# EAGLE schematic main (EAGLE 9.4.2)
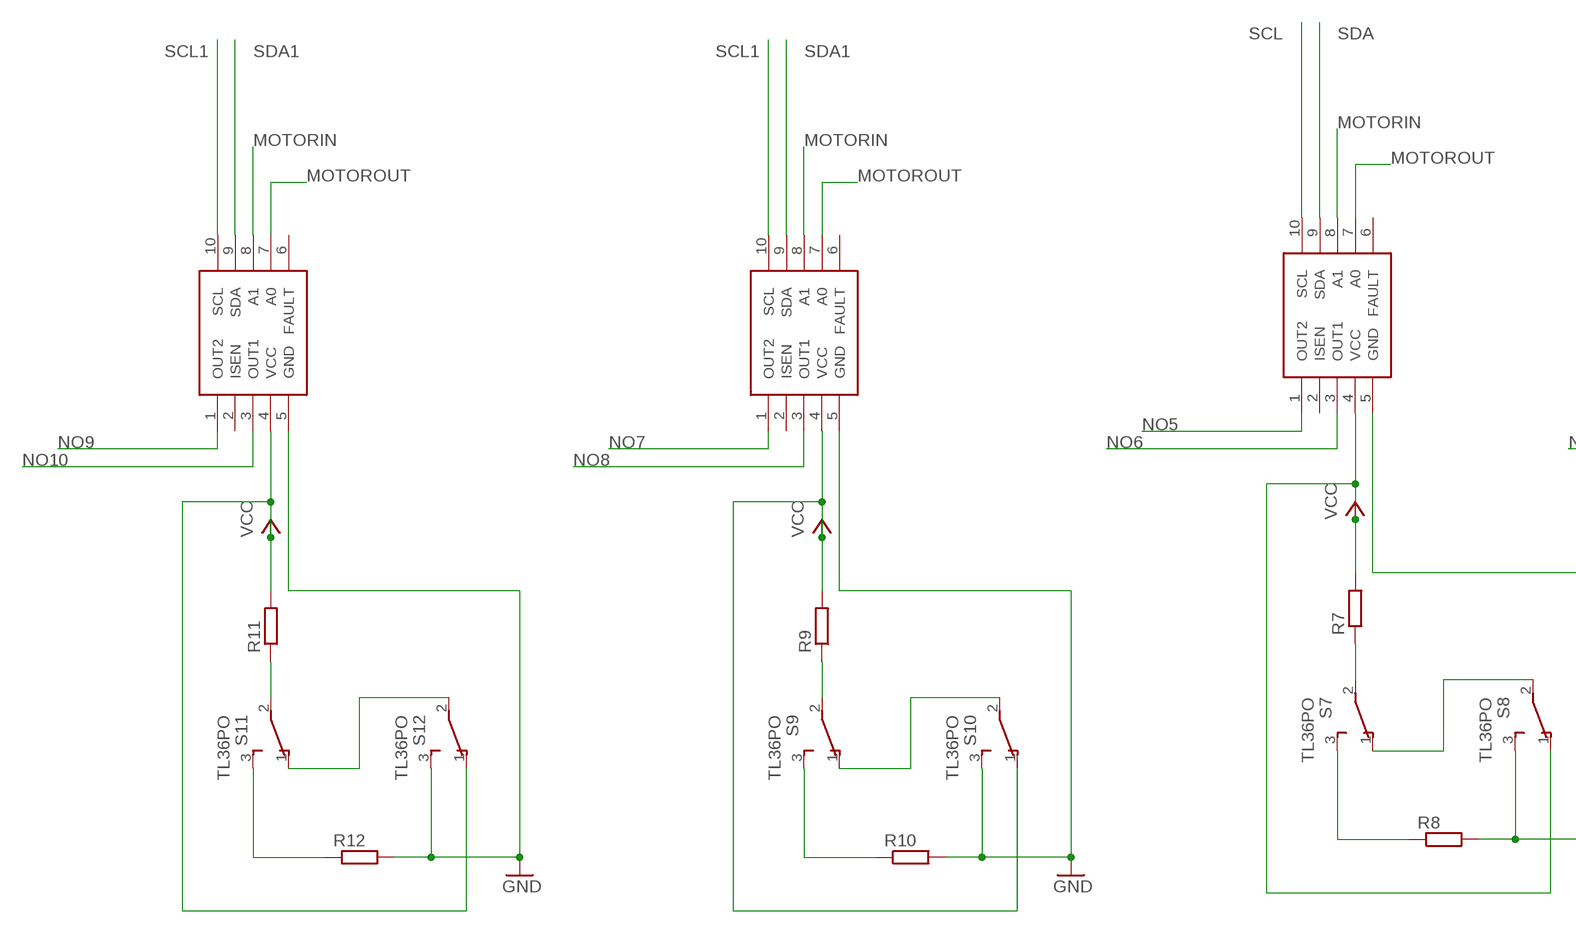
[diagram p0: schematic, sheet 1, part 1 of 2]
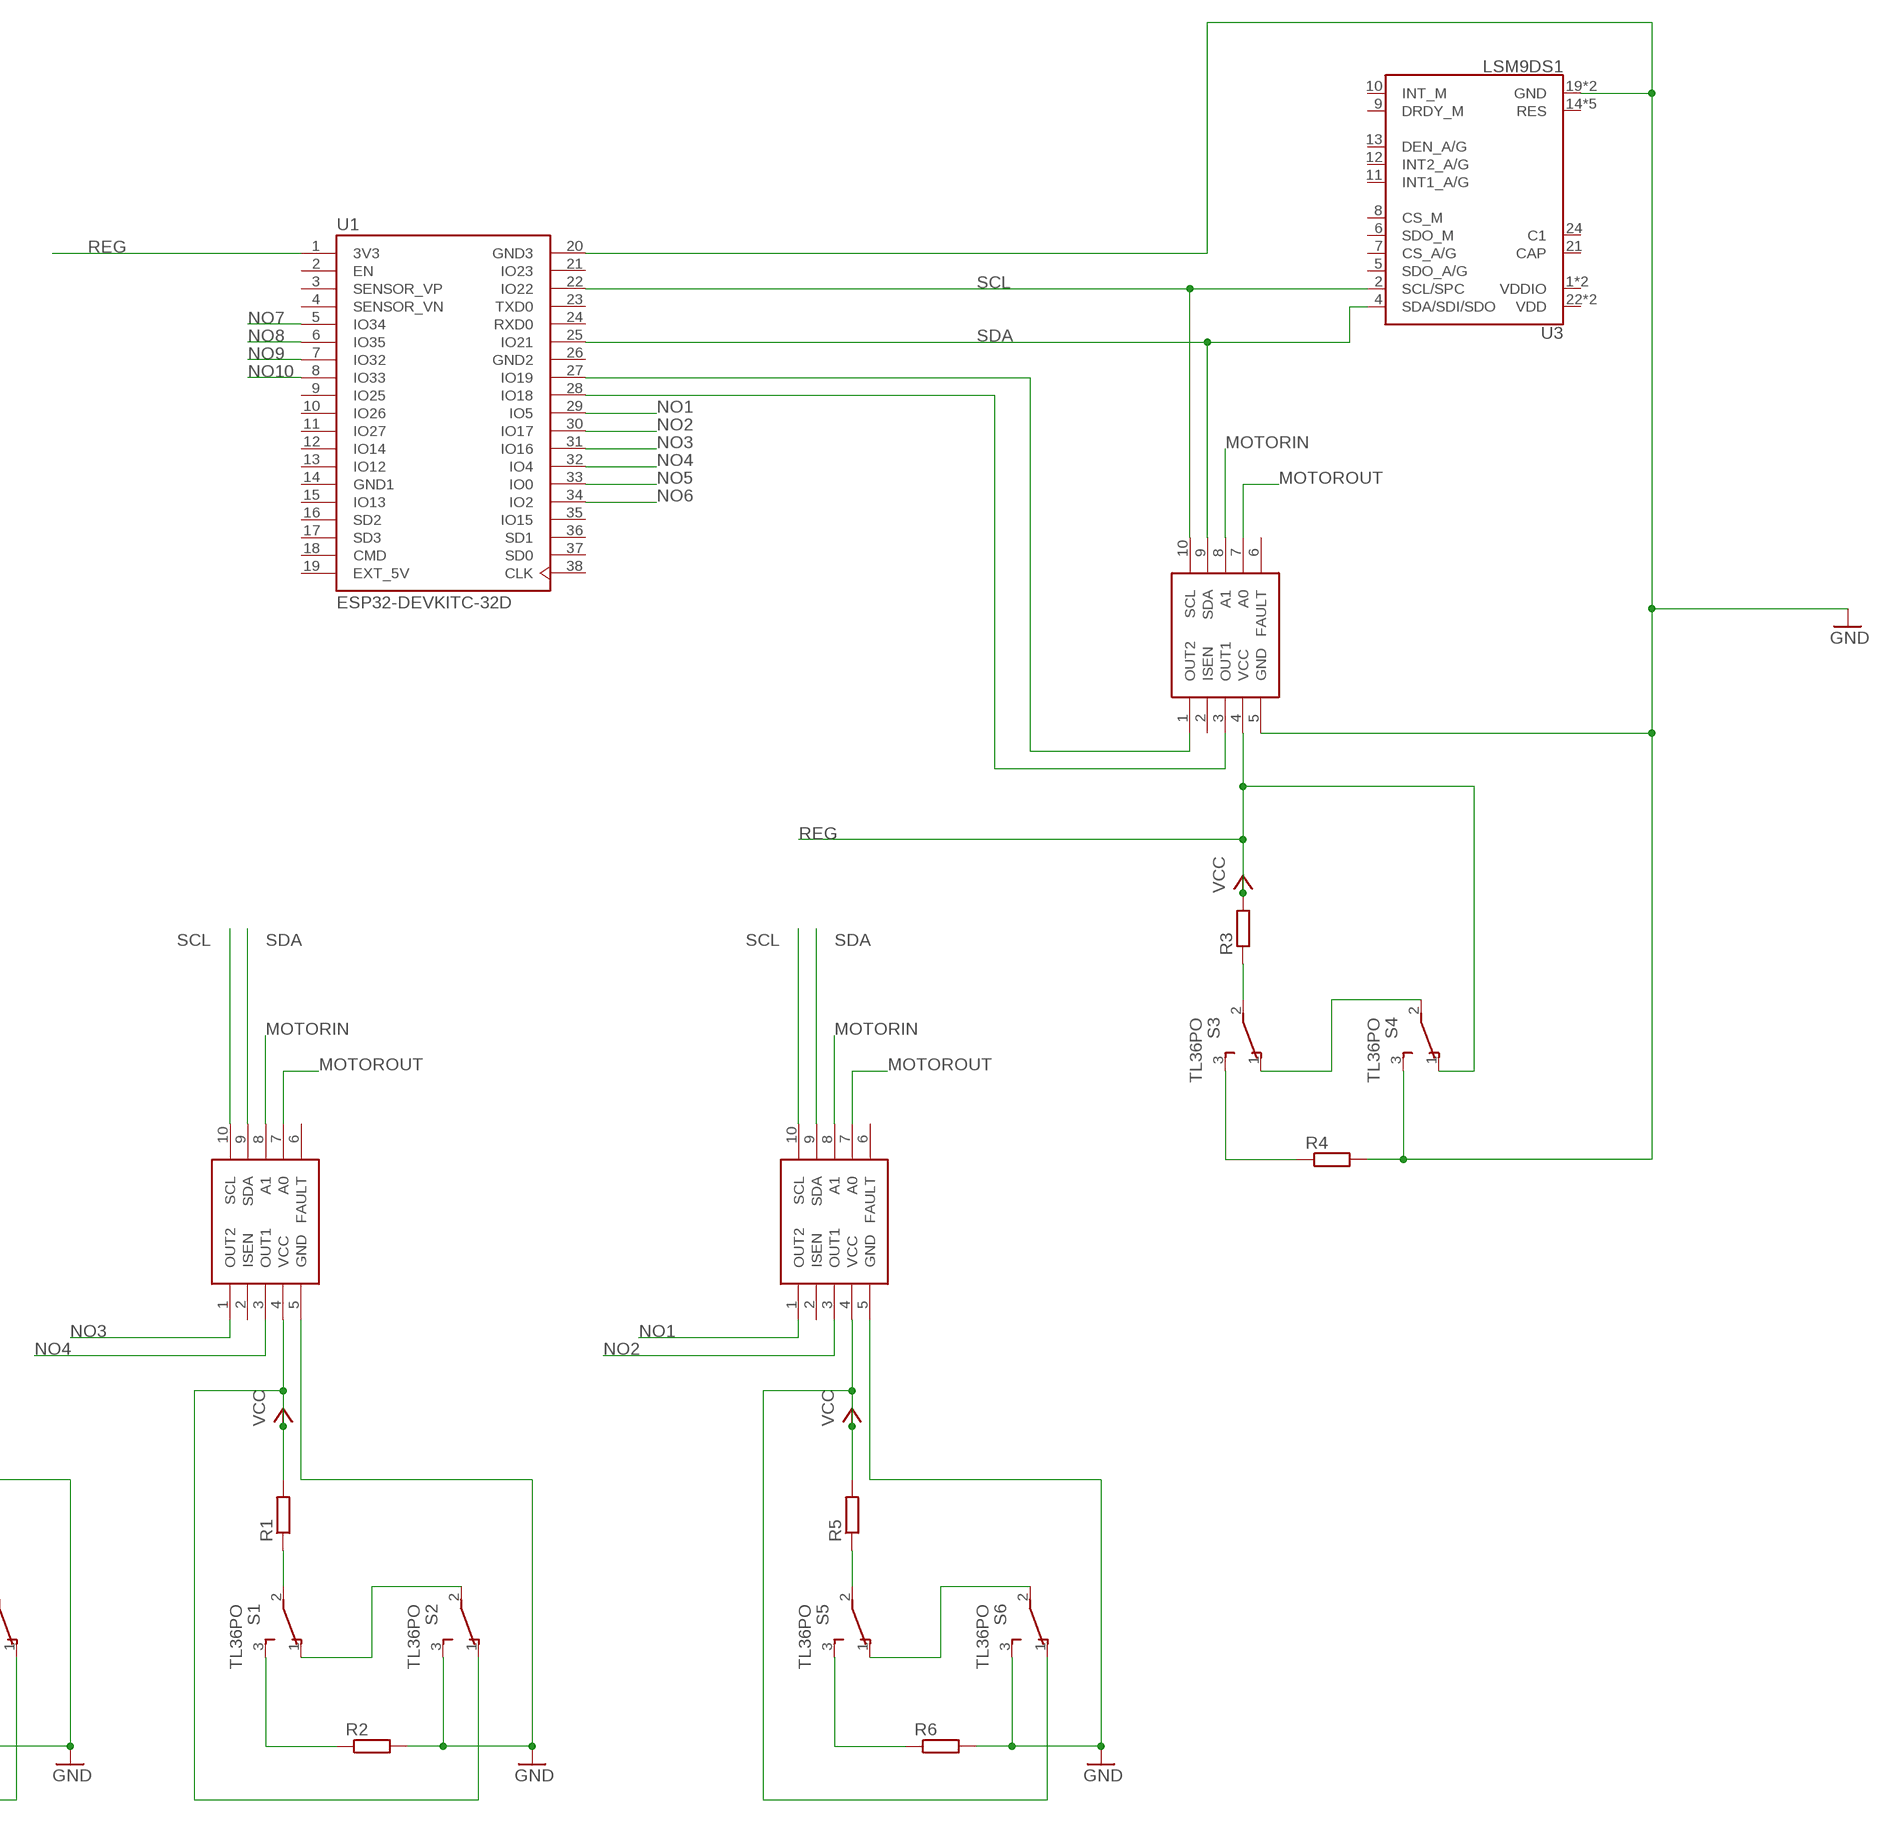
[diagram p1: schematic, sheet 1, part 2 of 2]

## Parts
R1  R-EU_0207/10  [0207/10]
R2  R-EU_0207/10  [0207/10]
R3  R-EU_0207/10  [0207/10]
R4  R-EU_0207/10  [0207/10]
R5  R-EU_0207/10  [0207/10]
R6  R-EU_0207/10  [0207/10]
R7  R-EU_0207/10  [0207/10]
R8  R-EU_0207/10  [0207/10]
R9  R-EU_0207/10  [0207/10]
R10  R-EU_0207/10  [0207/10]
R11  R-EU_0207/10  [0207/10]
R12  R-EU_0207/10  [0207/10]
S1  TL36PO  [TL3XPO]
S2  TL36PO  [TL3XPO]
S3  TL36PO  [TL3XPO]
S4  TL36PO  [TL3XPO]
S5  TL36PO  [TL3XPO]
S6  TL36PO  [TL3XPO]
S7  TL36PO  [TL3XPO]
S8  TL36PO  [TL3XPO]
S9  TL36PO  [TL3XPO]
S10  TL36PO  [TL3XPO]
S11  TL36PO  [TL3XPO]
S12  TL36PO  [TL3XPO]
U1  ESP32-DEVKITC-32D  [MODULE_ESP32-DEVKITC-32D]
U3  LSM9DS1  [LGA24-8X4]
U$1  DRV8830  [DRV8830]
U$2  DRV8830  [DRV8830]
U$3  DRV8830  [DRV8830]
U$4  DRV8830  [DRV8830]
U$5  DRV8830  [DRV8830]
U$6  DRV8830  [DRV8830]

## Nets
GND: R2.2 R4.2 R6.2 R8.2 R10.2 R12.2 S2.3(S) S4.3(S) S6.3(S) S8.3(S) S10.3(S) S12.3(S) U1.20(GND3) U3.19(GND) U3.20(GND) U$1.5(GND) U$2.5(GND) U$3.5(GND) U$4.5(GND) U$5.5(GND) U$6.5(GND)
MOTORIN: U$1.8(A1) U$2.8(A1) U$3.8(A1) U$4.8(A1) U$5.8(A1) U$6.8(A1)
MOTOROUT: U$1.7(A0) U$2.7(A0) U$3.7(A0) U$4.7(A0) U$5.7(A0) U$6.7(A0)
N$1: U1.27(IO19) U$2.1(OUT2)
N$2: U1.28(IO18) U$2.3(OUT1)
N$3: S1.1(O) S2.2(P)
N$4: R1.1 S1.2(P)
N$5: R2.1 S1.3(S)
N$6: S3.1(O) S4.2(P)
N$7: R3.1 S3.2(P)
N$8: R4.1 S3.3(S)
N$9: S5.1(O) S6.2(P)
N$10: R5.1 S5.2(P)
N$11: R6.1 S5.3(S)
N$12: S7.1(O) S8.2(P)
N$13: R7.1 S7.2(P)
N$14: R8.1 S7.3(S)
N$15: S9.1(O) S10.2(P)
N$16: R9.1 S9.2(P)
N$17: R10.1 S9.3(S)
N$18: S11.1(O) S12.2(P)
N$19: R11.1 S11.2(P)
N$20: R12.1 S11.3(S)
NO1: U1.29(IO5) U$3.1(OUT2)
NO2: U1.30(IO17) U$3.3(OUT1)
NO3: U1.31(IO16) U$1.1(OUT2)
NO4: U1.32(IO4) U$1.3(OUT1)
NO5: U1.33(IO0) U$4.1(OUT2)
NO6: U1.34(IO2) U$4.3(OUT1)
NO7: U1.5(IO34) U$5.1(OUT2)
NO8: U1.6(IO35) U$5.3(OUT1)
NO9: U1.7(IO32) U$6.1(OUT2)
NO10: U1.8(IO33) U$6.3(OUT1)
REG: R3.2 S4.1(O) U1.1(3V3) U$2.4(VCC) ; supply symbol labelled VCC
SCL: U1.22(IO22) U3.2(SCL/SPC) U$1.10(SCL) U$2.10(SCL) U$3.10(SCL) U$4.10(SCL)
SCL1: U$5.10(SCL) U$6.10(SCL)
SDA: U1.25(IO21) U3.4(SDA/SDI/SDO) U$1.9(SDA) U$2.9(SDA) U$3.9(SDA) U$4.9(SDA)
SDA1: U$5.9(SDA) U$6.9(SDA)
VCC: R1.2 R5.2 R7.2 R9.2 R11.2 S2.1(O) S6.1(O) S8.1(O) S10.1(O) S12.1(O) U$1.4(VCC) U$3.4(VCC) U$4.4(VCC) U$5.4(VCC) U$6.4(VCC)
Unconnected: U1.2(EN) U1.3(SENSOR_VP) U1.4(SENSOR_VN) U1.9(IO25) U1.10(IO26) U1.11(IO27) U1.12(IO14) U1.13(IO12) U1.15(IO13) U1.16(SD2) U1.17(SD3) U1.18(CMD) U1.21(IO23) U1.23(TXD0) U1.24(RXD0) U1.35(IO15) U1.36(SD1) U1.37(SD0) U1.38(CLK) U3.1(VDDIO) U3.3(VDDIO) U3.5(SDO_A/G) U3.6(SDO_M) U3.7(CS_A/G) U3.8(CS_M) U3.9(DRDY_M) U3.10(INT_M) U3.11(INT1_A/G) U3.12(INT2_A/G) U3.13(DEN_A/G) U3.14(RES) U3.15(RES) U3.16(RES) U3.17(RES) U3.18(RES) U3.21(CAP) U3.22(VDD) U3.23(VDD) U3.24(C1) U$1.2(ISEN) U$1.6(FAULT) U$2.2(ISEN) U$2.6(FAULT) U$3.2(ISEN) U$3.6(FAULT) U$4.2(ISEN) U$4.6(FAULT) U$5.2(ISEN) U$5.6(FAULT) U$6.2(ISEN) U$6.6(FAULT)

## Power pins joined to a net without a drawn wire
EXT_5V: U1.19(EXT_5V)
GND1: U1.14(GND1)
GND2: U1.26(GND2)

## Library data of the parts
R1-R12 = rcl:R-EU_: RESISTOR, European symbol; SPICEPREFIX: R
S1-S12 = switch:TL36PO: TINY SWITCH ON - ON Source: http://www2.produktinfo.conrad.com/datenblaetter/700000-724999/705152-da-01-de-Subminiaturschalter_TL_36YO.pdf
U1 = ESP32-DEVKITC-32D:ESP32-DEVKITC-32D: Eval Board For Esp-Wroom-32 Check prices <https://pricing.snapeda.com/parts/ESP32-DEVKITC-32D/Espressif%20Systems/view-part?ref=eda>; AVAILABILITY: Warning; DESCRIPTION: WiFi Development Tools (802.11) ESP32 General Development Kit, ESP32-WROOM-32D on the board; MF: Espressif Systems; MP: ESP32-DEVKITC-32D; PACKAGE: None; PRICE: None; PURCHASE-URL: https://pricing.snapeda.com/search/part/ESP32-DEVKITC-32D/?ref=eda
U3 = LSM9DS1_temp:LSM9DS1: LSM9DS1 3D accelerometer, gyroscope & magnetometer The LSM9DS1 is a system-in-package featuring a 3D digital linear acceleration sensor, a 3D digital angular rate sensor, and a 3D digital magnetic sensor. The LSM9DS1 has a linear acceleration full scale of ±2g/±4g/±8/±16 g, a magnetic field full scale of ±4/±8/±12/±16 gauss and an angular rate of ±245/±500/±2000 dps. The LSM9DS1 includes an I2 C serial bus interface supporting standard and fast mode (100 kHz and 400 kHz) and an SPI serial standard interface. Magnetic, accelerometer and gyroscope sensing can be enabled or set in power-down mode separately for smart power management. The LSM9DS1 is available in a plastic land grid array package (LGA) and it is guaranteed to operate over an extended temperature range from -40 °C to +85 °C.; PROD_ID: IC-12536
U$1-U$6 = FaBo-Motor:DRV8830